# Altium project GatorSynth_Step_Sequencer.PrjPcb (part 2 of 2)
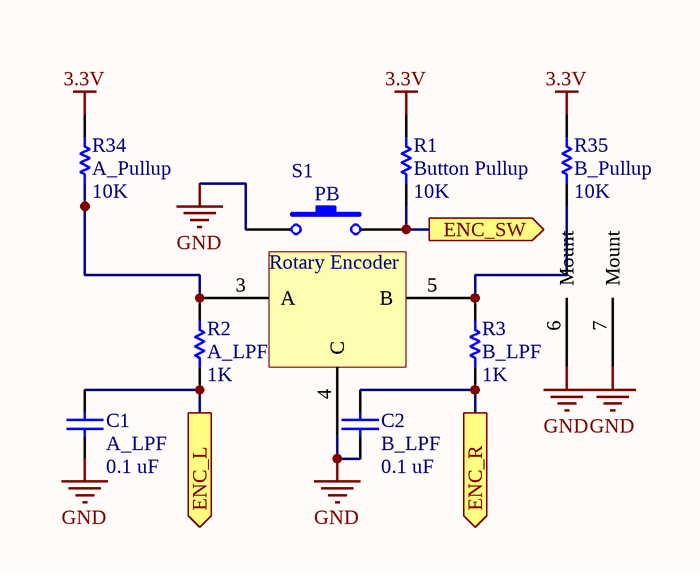
[diagram p12: Encoders.SchDoc]

## Nets that join several sheets
3.3V: Top_Level (R4.3 R25.2), Processor (12 pins), Jack_In (R31.2), Digital_Io (U5.8), EXP_BTN (8 pins), EXP_BTN (8 pins), Power (C28.1 L1.2 R33.1), RIB4 (5 pins), DISP0 (J3_DISP0.2 J3_DISP0.3 J3_DISP0.5 R9_DISP0.1), DISP1 (J3_DISP1.2 J3_DISP1.3 J3_DISP1.5 R9_DISP1.1), DISP2 (J3_DISP2.2 J3_DISP2.3 J3_DISP2.5 R9_DISP2.1), DISP3 (J3_DISP3.2 J3_DISP3.3 J3_DISP3.5 R9_DISP3.1), DISP4 (J3_DISP4.2 J3_DISP4.3 J3_DISP4.5 R9_DISP4.1), DISP5 (J3_DISP5.2 J3_DISP5.3 J3_DISP5.5 R9_DISP5.1), DISP6 (J3_DISP6.2 J3_DISP6.3 J3_DISP6.5 R9_DISP6.1), DISP7 (J3_DISP7.2 J3_DISP7.3 J3_DISP7.5 R9_DISP7.1), A1 (R1_A1.1 R34_A1.1 R35_A1.1), A2 (R1_A2.1 R34_A2.1 R35_A2.1), A3 (R1_A3.1 R34_A3.1 R35_A3.1), A4 (R1_A4.1 R34_A4.1 R35_A4.1), A5 (R1_A5.1 R34_A5.1 R35_A5.1), A6 (R1_A6.1 R34_A6.1 R35_A6.1), A7 (R1_A7.1 R34_A7.1 R35_A7.1), A8 (R1_A8.1 R34_A8.1 R35_A8.1), N1 (R1_N1.1 R34_N1.1 R35_N1.1), N2 (R1_N2.1 R34_N2.1 R35_N2.1), N3 (R1_N3.1 R34_N3.1 R35_N3.1), N4 (R1_N4.1 R34_N4.1 R35_N4.1), N5 (R1_N5.1 R34_N5.1 R35_N5.1), N6 (R1_N6.1 R34_N6.1 R35_N6.1), N7 (R1_N7.1 R34_N7.1 R35_N7.1), N8 (R1_N8.1 R34_N8.1 R35_N8.1), N9 (R1_N9.1 R34_N9.1 R35_N9.1), N10 (R1_N10.1 R34_N10.1 R35_N10.1), N11 (R1_N11.1 R34_N11.1 R35_N11.1), N12 (R1_N12.1 R34_N12.1 R35_N12.1), N13 (R1_N13.1 R34_N13.1 R35_N13.1), N14 (R1_N14.1 R34_N14.1 R35_N14.1), N15 (R1_N15.1 R34_N15.1 R35_N15.1), N16 (R1_N16.1 R34_N16.1 R35_N16.1)
5V: Power (P9.5 P9.6), CC1 (R15_CC1.1 R18_CC1.2 U2_CC1.4 U2_CC1.6), CC2 (R15_CC2.1 R18_CC2.2 U2_CC2.4 U2_CC2.6)
12V: GC1 (U4_GC1.8), Digital_Io (U6.8), Power (5 pins), GC0 (U4_GC0.8), CC1 (U3_CC1.8), CC2 (U3_CC2.8), RIB4 (5 pins)
-12V: GC1 (U4_GC1.4), Digital_Io (U6.4), Power (P9.15 P9.16), GC0 (U4_GC0.4), CC1 (U3_CC1.4), CC2 (U3_CC2.4)
GND: Top_Level (7 pins), GC1 (R20_GC1.1 R22_GC1.2), Processor (17 pins), Jack_In (J6.3 J6.5), Digital_Io (R24.1 R28.1 R30.1 U5.4), EXP_BTN (C23_EXP_BTN#1.2 EXP1_EXP_BTN#1.3 EXP1_EXP_BTN#1.12), EXP_BTN (C23_EXP_BTN#2.2 EXP1_EXP_BTN#2.3 EXP1_EXP_BTN#2.12), Power (10 pins), GC0 (R20_GC0.1 R22_GC0.2), CC1 (5 pins), CC2 (5 pins), RIB4 (6 pins), DISP0 (5 pins), DISP1 (5 pins), DISP2 (5 pins), DISP3 (5 pins), DISP4 (5 pins), DISP5 (5 pins), DISP6 (5 pins), DISP7 (5 pins), A1 (6 pins), A2 (6 pins), A3 (6 pins), A4 (6 pins), A5 (6 pins), A6 (6 pins), A7 (6 pins), A8 (6 pins), N1 (6 pins), N2 (6 pins), N3 (6 pins), N4 (6 pins), N5 (6 pins), N6 (6 pins), N7 (6 pins), N8 (6 pins), N9 (6 pins), N10 (6 pins), N11 (6 pins), N12 (6 pins), N13 (6 pins), N14 (6 pins), N15 (6 pins), N16 (6 pins)
AE_L0: Processor (U1.74), RIB1 (P9_RIB1.1), A1 (C1_A1.2 R2_A1.2)
AE_L1: Processor (U1.52), RIB1 (P9_RIB1.3), A2 (C1_A2.2 R2_A2.2)
AE_L2: Processor (U1.48), RIB1 (P9_RIB1.5), A3 (C1_A3.2 R2_A3.2)
AE_L3: Processor (U1.28), RIB1 (P9_RIB1.7), A4 (C1_A4.2 R2_A4.2)
AE_L4: Processor (U1.24), RIB1 (P9_RIB1.9), A5 (C1_A5.2 R2_A5.2)
AE_L5: Processor (U1.20), RIB1 (P9_RIB1.11), A6 (C1_A6.2 R2_A6.2)
AE_L6: Processor (U1.34), RIB1 (P9_RIB1.13), A7 (C1_A7.2 R2_A7.2)
AE_L7: Processor (U1.39), RIB1 (P9_RIB1.15), A8 (C1_A8.2 R2_A8.2)
AE_R0: Processor (U1.72), RIB1 (P9_RIB1.2), A1 (C2_A1.2 R3_A1.2)
AE_R1: Processor (U1.49), RIB1 (P9_RIB1.4), A2 (C2_A2.2 R3_A2.2)
AE_R2: Processor (U1.46), RIB1 (P9_RIB1.6), A3 (C2_A3.2 R3_A3.2)
AE_R3: Processor (U1.12), RIB1 (P9_RIB1.8), A4 (C2_A4.2 R3_A4.2)
AE_R4: Processor (U1.15), RIB1 (P9_RIB1.10), A5 (C2_A5.2 R3_A5.2)
AE_R5: Processor (U1.22), RIB1 (P9_RIB1.12), A6 (C2_A6.2 R3_A6.2)
AE_R6: Processor (U1.38), RIB1 (P9_RIB1.14), A7 (C2_A7.2 R3_A7.2)
AE_R7: Processor (U1.57), RIB1 (P9_RIB1.16), A8 (C2_A8.2 R3_A8.2)
AE_SW0: EXP_BTN (EXP1_EXP_BTN#2.13 R12_EXP_BTN#2.4), A1 (R1_A1.2 S1_A1.2)
AE_SW1: EXP_BTN (EXP1_EXP_BTN#2.14 R12_EXP_BTN#2.3), A2 (R1_A2.2 S1_A2.2)
AE_SW2: EXP_BTN (EXP1_EXP_BTN#2.15 R12_EXP_BTN#2.2), A3 (R1_A3.2 S1_A3.2)
AE_SW3: EXP_BTN (EXP1_EXP_BTN#2.16 R12_EXP_BTN#2.1), A4 (R1_A4.2 S1_A4.2)
AE_SW4: EXP_BTN (EXP1_EXP_BTN#2.17 R12_EXP_BTN#2.9), A5 (R1_A5.2 S1_A5.2)
AE_SW5: EXP_BTN (EXP1_EXP_BTN#2.18 R12_EXP_BTN#2.8), A6 (R1_A6.2 S1_A6.2)
AE_SW6: EXP_BTN (EXP1_EXP_BTN#2.19 R12_EXP_BTN#2.7), A7 (R1_A7.2 S1_A7.2)
AE_SW7: EXP_BTN (EXP1_EXP_BTN#2.20 R12_EXP_BTN#2.6), A8 (R1_A8.2 S1_A8.2)
BPM_IN: Jack_In (J6.1), Digital_Io (U5.3)
BPM_OUT: Processor (U1.41), Digital_Io (U6.3)
BPM_TRIG: Processor (U1.53), Digital_Io (C26.1 D1.2 R23.2 U5.1)
BTN_INT: Processor (U1.88), EXP_BTN (EXP1_EXP_BTN#1.1 R10_EXP_BTN#1.1), RIB3 (P9_RIB3.2)
CS1: Processor (U1.93), CC1 (U2_CC1.1)
CS2: Processor (U1.99), CC2 (U2_CC2.1)
DISP_RESET: Processor (U1.81), RIB3 (P9_RIB3.11), DISP0 (J3_DISP0.7), DISP1 (J3_DISP1.7), DISP2 (J3_DISP2.7), DISP3 (J3_DISP3.7), DISP4 (J3_DISP4.7), DISP5 (J3_DISP5.7), DISP6 (J3_DISP6.7), DISP7 (J3_DISP7.7)
DISP_SEL0: Processor (U1.59), RIB3 (P9_RIB3.8)
DISP_SEL1: Processor (U1.63), RIB3 (P9_RIB3.9)
DISP_SEL2: Processor (U1.64), RIB3 (P9_RIB3.10)
ENC_INT: Processor (U1.89), EXP_BTN (EXP1_EXP_BTN#2.1 R10_EXP_BTN#2.1), RIB3 (P9_RIB3.1)
GATE_OUT1: Processor (U1.3), GC0 (U4_GC0.3)
GATE_OUT2: Processor (U1.5), GC0 (U4_GC0.5)
GATE_OUT3: GC1 (U4_GC1.3), Processor (U1.7)
GATE_OUT4: GC1 (U4_GC1.5), Processor (U1.9)
JACK_INT: Processor (U1.44), Jack_In (J6.4 R31.1)
MOSI: Processor (U1.33), CC1 (U2_CC1.3), CC2 (U2_CC2.3), RIB3 (P9_RIB3.5)
NE_L0: Processor (U1.25), RIB0 (P9_RIB0.1), N1 (C1_N1.2 R2_N1.2)
NE_L1: Processor (U1.43), RIB0 (P9_RIB0.3), N2 (C1_N2.2 R2_N2.2)
NE_L2: Processor (U1.37), RIB0 (P9_RIB0.5), N3 (C1_N3.2 R2_N3.2)
NE_L3: Processor (U1.32), RIB0 (P9_RIB0.7), N4 (C1_N4.2 R2_N4.2)
NE_L4: Processor (U1.58), RIB0 (P9_RIB0.9), N5 (C1_N5.2 R2_N5.2)
NE_L5: Processor (U1.65), RIB0 (P9_RIB0.11), N6 (C1_N6.2 R2_N6.2)
NE_L6: Processor (U1.23), RIB0 (P9_RIB0.13), N7 (C1_N7.2 R2_N7.2)
NE_L7: Processor (U1.71), RIB0 (P9_RIB0.15), N8 (C1_N8.2 R2_N8.2)
NE_L8: Processor (U1.73), RIB2 (P9_RIB2.1), N9 (C1_N9.2 R2_N9.2)
NE_L9: Processor (U1.78), RIB2 (P9_RIB2.3), N10 (C1_N10.2 R2_N10.2)
NE_L10: Processor (U1.82), RIB2 (P9_RIB2.5), N11 (C1_N11.2 R2_N11.2)
NE_L11: Processor (U1.86), RIB2 (P9_RIB2.7), N12 (C1_N12.2 R2_N12.2)
NE_L12: Processor (U1.92), RIB2 (P9_RIB2.9), N13 (C1_N13.2 R2_N13.2)
NE_L13: Processor (U1.13), RIB2 (P9_RIB2.11), N14 (C1_N14.2 R2_N14.2)
NE_L14: Processor (U1.54), RIB2 (P9_RIB2.13), N15 (C1_N15.2 R2_N15.2)
NE_L15: Processor (U1.6), RIB2 (P9_RIB2.15), N16 (C1_N16.2 R2_N16.2)
NE_R0: Processor (U1.47), RIB0 (P9_RIB0.2), N1 (C2_N1.2 R3_N1.2)
NE_R1: Processor (U1.40), RIB0 (P9_RIB0.4), N2 (C2_N2.2 R3_N2.2)
NE_R2: Processor (U1.35), RIB0 (P9_RIB0.6), N3 (C2_N3.2 R3_N3.2)
NE_R3: Processor (U1.29), RIB0 (P9_RIB0.8), N4 (C2_N4.2 R3_N4.2)
NE_R4: Processor (U1.62), RIB0 (P9_RIB0.10), N5 (C2_N5.2 R3_N5.2)
NE_R5: Processor (U1.68), RIB0 (P9_RIB0.12), N6 (C2_N6.2 R3_N6.2)
NE_R6: Processor (U1.21), RIB0 (P9_RIB0.14), N7 (C2_N7.2 R3_N7.2)
NE_R7: Processor (U1.19), RIB0 (P9_RIB0.16), N8 (C2_N8.2 R3_N8.2)
NE_R8: Processor (U1.75), RIB2 (P9_RIB2.2), N9 (C2_N9.2 R3_N9.2)
NE_R9: Processor (U1.80), RIB2 (P9_RIB2.4), N10 (C2_N10.2 R3_N10.2)
NE_R10: Processor (U1.84), RIB2 (P9_RIB2.6), N11 (C2_N11.2 R3_N11.2)
NE_R11: Processor (U1.90), RIB2 (P9_RIB2.8), N12 (C2_N12.2 R3_N12.2)
NE_R12: Processor (U1.94), RIB2 (P9_RIB2.10), N13 (C2_N13.2 R3_N13.2)
NE_R13: Processor (U1.17), RIB2 (P9_RIB2.12), N14 (C2_N14.2 R3_N14.2)
NE_R14: Processor (U1.4), RIB2 (P9_RIB2.14), N15 (C2_N15.2 R3_N15.2)
NE_R15: Processor (U1.8), RIB2 (P9_RIB2.16), N16 (C2_N16.2 R3_N16.2)
NE_SW0: EXP_BTN (EXP1_EXP_BTN#2.4 R11_EXP_BTN#2.4), N1 (R1_N1.2 S1_N1.2)
NE_SW1: EXP_BTN (EXP1_EXP_BTN#2.5 R11_EXP_BTN#2.3), N2 (R1_N2.2 S1_N2.2)
NE_SW2: EXP_BTN (EXP1_EXP_BTN#2.6 R11_EXP_BTN#2.2), N3 (R1_N3.2 S1_N3.2)
NE_SW3: EXP_BTN (EXP1_EXP_BTN#2.7 R11_EXP_BTN#2.1), N4 (R1_N4.2 S1_N4.2)
NE_SW4: EXP_BTN (EXP1_EXP_BTN#2.8 R11_EXP_BTN#2.9), N5 (R1_N5.2 S1_N5.2)
NE_SW5: EXP_BTN (EXP1_EXP_BTN#2.9 R11_EXP_BTN#2.8), N6 (R1_N6.2 S1_N6.2)
NE_SW6: EXP_BTN (EXP1_EXP_BTN#2.10 R11_EXP_BTN#2.7), N7 (R1_N7.2 S1_N7.2)
NE_SW7: EXP_BTN (EXP1_EXP_BTN#2.11 R11_EXP_BTN#2.6), N8 (R1_N8.2 S1_N8.2)
NOTE_LEN: Top_Level (R4.2), Processor (U1.18), RIB3 (P9_RIB3.7)
PLAY/PAUSE_LED: Processor (U1.14), Digital_Io (U6.5)
PP_BTN: Top_Level (P8.SIG2 R25.1), Processor (U1.67), RIB3 (P9_RIB3.12)
PP_LED: Top_Level (P8.GRN1), Digital_Io (R26.2), RIB3 (P9_RIB3.13)
SCL: Processor (U1.55), EXP_BTN (EXP1_EXP_BTN#1.22), EXP_BTN (EXP1_EXP_BTN#2.22), RIB3 (P9_RIB3.4), DISP0 (J3_DISP0.9), DISP1 (J3_DISP1.9), DISP2 (J3_DISP2.9), DISP3 (J3_DISP3.9), DISP4 (J3_DISP4.9), DISP5 (J3_DISP5.9), DISP6 (J3_DISP6.9), DISP7 (J3_DISP7.9)
SDA: Processor (U1.66), EXP_BTN (EXP1_EXP_BTN#1.23), EXP_BTN (EXP1_EXP_BTN#2.23), RIB3 (P9_RIB3.3)
SPCK: Processor (U1.31), CC1 (U2_CC1.2), CC2 (U2_CC2.2), RIB3 (P9_RIB3.6)